# Altium project Voltage detect.PrjPcb
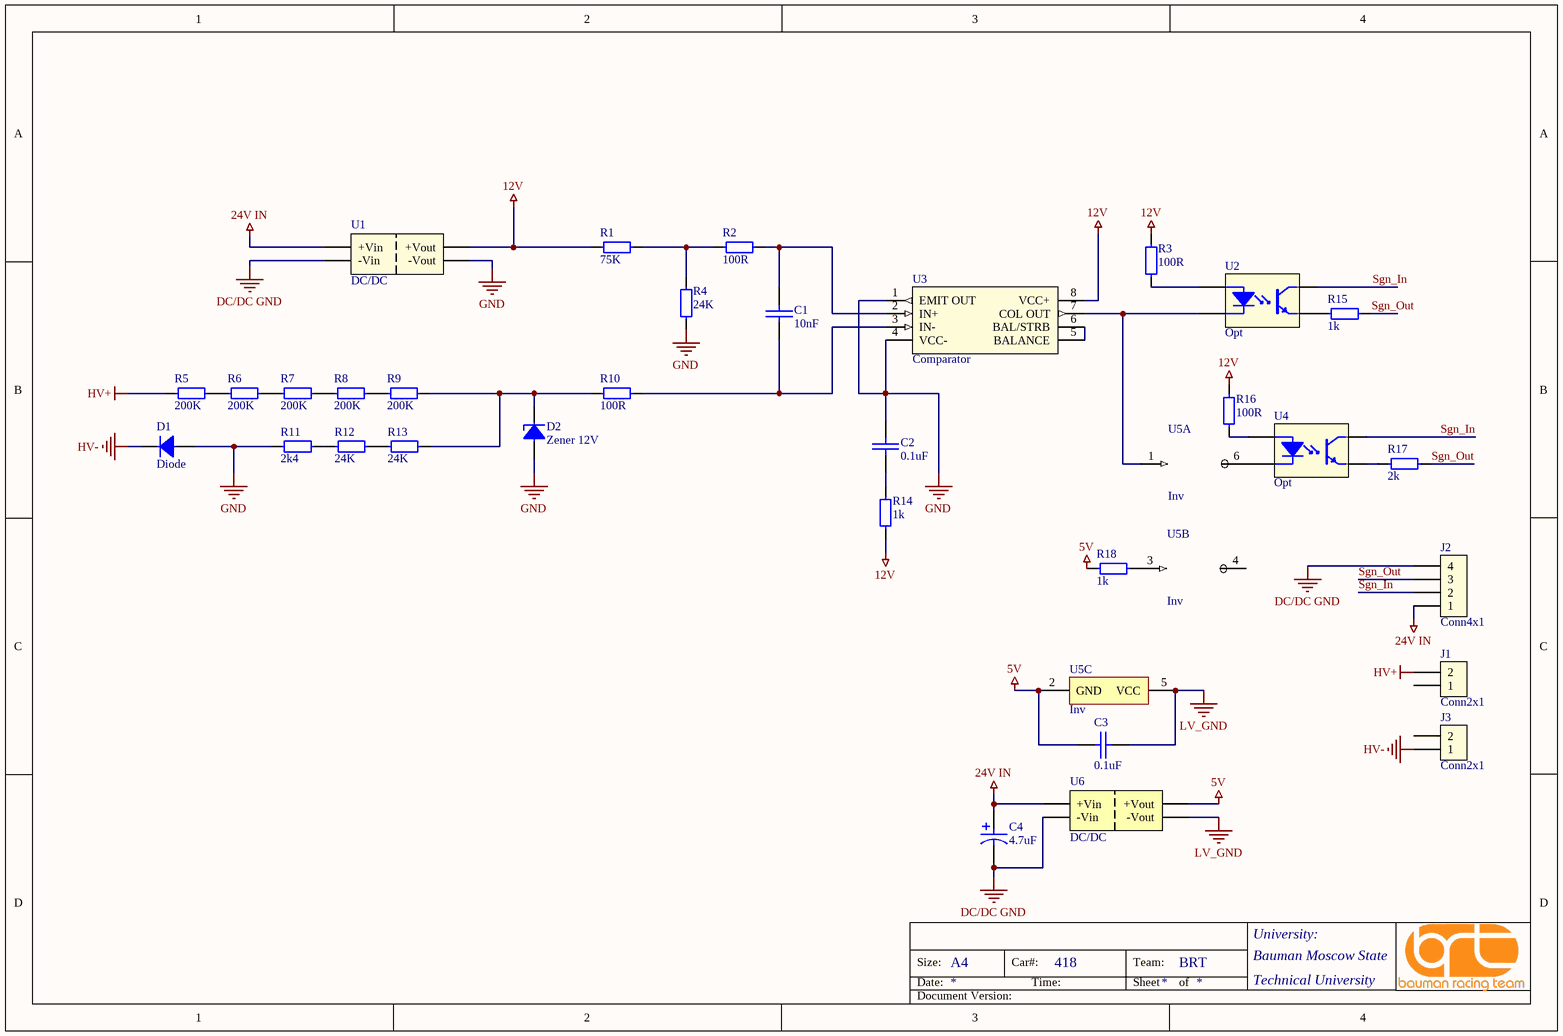
[diagram p0: Voltage detect.SchDoc]
CAGE_CODE: ?????; CONTRACT_NUMBER: <CONTRACT NO>; DOC_NO_ASSY_DWG: <ASSY DWG NO>; DOC_NO_BOM: <BOM DOC NO>; DOC_NO_FAB_DWG: <FAB DWG NO>; DOC_NO_SCH_DWG: <SCH DWG NO>; PCB_2_DEC_TOL: +/-.01; PCB_3_DEC_TOL: +/-.010; PCB_ANG_TOL: +/-1/2; PCB_ASSEMBLY_NO: <PCB ASSY NO>; PCB_CHECKER: - -----; PCB_CHECKER_APP_DATE: --/--/----; PCB_DESIGNER: - -----; PCB_DESIGNER_APP_DATE: --/--/----; PCB_DWG_NO: <PCB DWG NO>; PCB_ENGINEER: - -----; PCB_ENGINEER_APP_DATE: --/--/----; PCB_PART_NUMBER: <PCB PN>; PCB_REV: A; SCH_REV: A
1 sheet, 33 parts. Net scope: global (net labels, ports and power ports of the same name join across sheets).
Board file: Voltage detect.PcbDoc

## Sheet Voltage detect.SchDoc
size A4; ENG_APP_DATE: --/--/--; DSN_APP_DATE: --/--/--; CHK_APP_DATE: --/--/--

### Parts
C1  10nF  [0805 Capicator]
C2  0.1uF  [0805 Capicator]
C3  0.1uF  [0805 Capicator]
C4  4.7uF  [Bar Cap 4x5.4]
D1  Diode  [BY12]
D2  Zener 12V  [sod-323]
J1  Conn2x1  [MolexMicroFit 2x1]
J2  Conn4x1  [MolexMicroFit 4x1]
J3  Conn2x1  [MolexMicroFit 2x1]
R1  75K  [0805 Resistor]
R2  100R  [0805 Resistor]
R3  100R  [0805 Resistor]
R4  24K  [0805 Resistor]
R5  200K  [0805 Resistor]
R6  200K  [0805 Resistor]
R7  200K  [0805 Resistor]
R8  200K  [0805 Resistor]
R9  200K  [0805 Resistor]
R10  100R  [0805 Resistor]
R11  2k4  [0805 Resistor]
R12  24K  [0805 Resistor]
R13  24K  [0805 Resistor]
R14  1k  [0805 Resistor]
R15  1k  [0603 Resistor]
R16  100R  [0805 Resistor]
R17  2k  [0603 Resistor]
R18  1k  [0805 Resistor]
U1  DC/DC  [SIP7]
U2  Opt  [FAIR-MDIP-4_V]
U3  Comparator  [SO-8]
U4  Opt  [FAIR-MDIP-4_V]
U5  Inv  [SOT236]  (parts A,B,C of 3)
U6  DC/DC  [SIP7]

### Nets
5V: C3.1 R18.2 U5.2(GND) U6.6(+Vout)
12V: R1.1 R3.2 R14.1 R16.2 U1.6(+Vout) U3.8(VCC+)
24V IN: C4.2 J2.1 U1.1(+Vin) U6.1(+Vin)
DC/DC GND: C4.1 J2.4 U1.2(-Vin) U6.2(-Vin)
GND: C2.2 D1.1 D2.1 R4.1 R11.1 U1.4(-Vout) U3.1(EMIT_OUT) U3.4(VCC-)
HV+: J1.2 R5.1
HV-: D1.2 J3.1
LV_GND: C3.2 U5.5(VCC) U6.4(-Vout)
Sgn_In: J2.2 U2.4(COLLECTOR) U4.4(COLLECTOR)
Sgn_Out: J2.3 R15.2 R17.2
NetC1_1: C1.1 R10.2 U3.3(IN-)
NetC1_2: C1.2 R2.2 U3.2(IN+)
NetC2_1: C2.1 R14.2
NetD2_2: D2.2 R9.2 R10.1 R13.2
NetR1_2: R1.2 R2.1 R4.2
NetR3_1: R3.1 U2.1(ANODE)
NetR5_2: R5.2 R6.1
NetR6_2: R6.2 R7.1
NetR7_2: R7.2 R8.1
NetR8_2: R8.2 R9.1
NetR11_2: R11.2 R12.2
NetR12_1: R12.1 R13.1
NetR15_1: R15.1 U2.3(EMITTER)
NetR16_1: R16.1 U4.1(ANODE)
NetR17_1: R17.1 U4.3(EMITTER)
NetR18_1: R18.1 U5.3(A)
NetU2_2: U2.2(CATHODE) U3.7(COL_OUT) U5.1(A)
NetU3_5: U3.5(BALANCE) U3.6(BAL/STRB)
NetU4_2: U4.2(CATHODE) U5.6(Y)

Not connected (* = marked no-connect by the designer): J1 1; J3 2; U5 4(Y)

### Notes on the sheet
- Size:
- Date:
- A4
- Car#:
- Time:
- 418
- Team:
- Sheet
- BRT
- of
- University:
- Technical University
- Bauman Moscow State
- Document Version:

### Library data of the parts
C1 = Cap 10nF (0805): 0805 X7R 10nF 100V 10%; Manufacturer: Murata Manufacturing; Part Number: GRM21BR72A103KA01L; Type: Capacitor; ComponentLink1Description: Chip&Dip; ComponentLink1URL: https://www.chipdip.ru/product/grm21br72a103ka01l
C2 = Cap 0.1uF (0805): 0.1uF X7R 50V 10% 0805; Manufacturer: Murata Manufacturing; Part Number: GRM21BR71H104K; Type: Capacitor; ComponentLink1Description: Chip&Dip; ComponentLink1URL: https://www.chipdip.ru/product/grm21br71h104k
C3 = Cap 0.1uF (0805): 0.1uF X7R 50V 10% 0805; Manufacturer: Murata Manufacturing; Part Number: GRM21BR71E104KA01L; Type: Capacitor; ComponentLink1Description: Chip&Dip; ComponentLink1URL: https://www.chipdip.ru/product/grm21br71e104ka01l
C4 = Cap Pol 4.7uF: ECAP SMD,  35V, 105°C; Part Number: B41121A7475M000; Manufacturer: Epcos; Type: Capacitor; ComponentLink1Description: Chip&Dip; ComponentLink1URL: https://www.chipdip.ru/product/b41121a7475m000
D1 = BY12: BY12 - Highg voltage diode; ComponentLink1Description: ChipDip; ComponentLink1URL: https://www.chipdip.ru/product/by12; ComponentLink2Description: Datasheet; ComponentLink2URL: https://static.chipdip.ru/lib/508/DOC001508556.pdf
D2 = Zener Diode 12V: 300mW; Part Number: BZX384-C12,115; Manufacturer: NXP Semiconductor; Type: Diode; ComponentLink1Description: Chip&Dip; ComponentLink1URL: https://www.chipdip.ru/product/bzx384-c12.115; ComponentLink2Description: DataSheet; ComponentLink2URL: https://static.chipdip.ru/lib/583/DOC001583013.pdf
J1 J3 = Conn2x1 [MicroFit]: Micro-Fit 3.0 Right-Angle Header, 3.00mm Pitch, Single Row, 2 Circuits, with Snap-in Plastic Peg PCB Lock, Tin, Glow-Wire Capable, Black; Part Number: 436500200; Manufacturer: Molex; ComponentLink1Description: Molex; ComponentLink1URL: https://www.molex.com/molex/products/part-detail/pcb_headers/0436500200; Type: Connector
J2 = Conn4x1 [MicroFit]: Micro-Fit 3.0 Right-Angle Header, 3.00mm Pitch, Single Row, 4 Circuits, with Snap-in Plastic Peg PCB Lock, Tin, Glow-Wire Capable, Black; Part Number: 436500400; Manufacturer: Molex; ComponentLink1Description: Molex; ComponentLink1URL: https://www.molex.com/molex/products/part-detail/pcb_headers/0436500400; Type: Connector
R1 = Res 75K (0805): 0.125W 0805 75K, 1%; Part Number: RC0805FR-0775KL; Manufacturer: Taiwan; Type: Resistor; ComponentLink1Description: Chip&Dip; ComponentLink1URL: https://www.chipdip.ru/product0/9000079535
R2 R3 R10 R16 = Res 100R (0805): 0.125W 0805 100R, 1%; Part Number: RC0805FR-07100RL; Manufacturer: Taiwan; Type: Resistor; ComponentLink1Description: Chip&Dip; ComponentLink1URL: https://www.chipdip.ru/product0/9000079462
R4 R12 R13 = Res 24K (0805): 0.125W 0805 24K, 1%; Part Number: RC0805FR-0724KL; Manufacturer: Taiwan; Type: Resistor; ComponentLink1Description: Chip&Dip; ComponentLink1URL: https://www.chipdip.ru/product0/9000079523
R5-R9 = Res 200K (0805): 0.125W 0805 200K, 1%; Part Number: RC0805FK-07200KL; Manufacturer: Taiwan; Type: Resistor; ComponentLink1Description: Chip&Dip; ComponentLink1URL: https://www.chipdip.ru/product0/914213016
R11 = Res 2.4k (0805): 0.125W 0805 2.4k, 1%; Part Number: RC0805FR-072K4L; Manufacturer: Taiwan; Type: Resistor; ComponentLink1Description: Chip&Dip; ComponentLink1URL: https://www.chipdip.ru/product0/9000079495
R14 R18 = Res 1k (0805): 0.125W 0805 1k, 1%; Part Number: RC0805FR-071KL; Manufacturer: Taiwan; Type: Resistor; ComponentLink1Description: Chip&Dip; ComponentLink1URL: https://www.chipdip.ru/product0/9000079486
R15 = Res 1k (0603): 0.1W 0603 1k, 1%; Part Number: RC0603FR-071KL; Manufacturer: Taiwan; Type: Resistor; ComponentLink1Description: Chip&Dip; ComponentLink1URL: https://www.chipdip.ru/product0/9000079676
R17 = Res 2k (0603): 0.1W 0603 2k, 1%; Part Number: RC0603FR-072KL; Manufacturer: Taiwan; Type: Resistor; ComponentLink1Description: Chip&Dip; ComponentLink1URL: https://www.chipdip.ru/product0/9000079719
U1 = DC/DC Isolated [TMH]: The TMH series are ultra miniature, isolated 2 Watt DC/DC-converters in a Single-in-Line  package  (SIP); ComponentLink1Description: Chip&Dip; ComponentLink1URL: https://www.chipdip.ru/product/tmh-1205s; ComponentLink2Description: New link; ComponentLink2URL: https://static.chipdip.ru/lib/005/DOC001005854.pdf
U2 U4 = Optocoupler [FOD817B]: Phototransistor Optocoupler, 4 us Rise, 3 us Fall, 5000 Vrms, -55 to 110 degC, 4-Pin MDIP, RoHS, Tape and Reel; Manufacturer: ON Semiconductor; Part Nomber: FOD817B; ComponentLink1Description: CHIPDIP; ComponentLink1URL: https://www.chipdip.ru/product/fod817b; ComponentLink2Description: Datasheet; ComponentLink2URL: https://static.chipdip.ru/lib/297/DOC000297284.pdf
U3 = Comparator [LM3]: Differential comparator with strobes; Part Number: LM311DR; Manufacturer: Texas Instruments; ComponentLink1Description: DataSheet; ComponentLink1URL: https://static.chipdip.ru/lib/222/DOC000222396.pdf; ComponentLink2Description: Chip&Dip; ComponentLink2URL: https://www.chipdip.ru/product/lm311d; Type: IC
U5 = Inverter: Chip&Dip: https://www.chipdip.ru/product/sn74lvc2g04dbvr-2
U6 = DC/DC Isolated 5V [TMH]: The TMH series are ultra miniature, isolated 2 Watt DC/DC-converters in a Single-in-Line  package  (SIP); Manufacturer: Traco Power; Part Number: TMH2405S; ComponentLink1Description: Chip&Dip; ComponentLink1URL: https://www.chipdip.ru/product/tmh-2405s; ComponentLink2Description: DataSheet; ComponentLink2URL: https://static.chipdip.ru/lib/005/DOC001005854.pdf; Type: IC